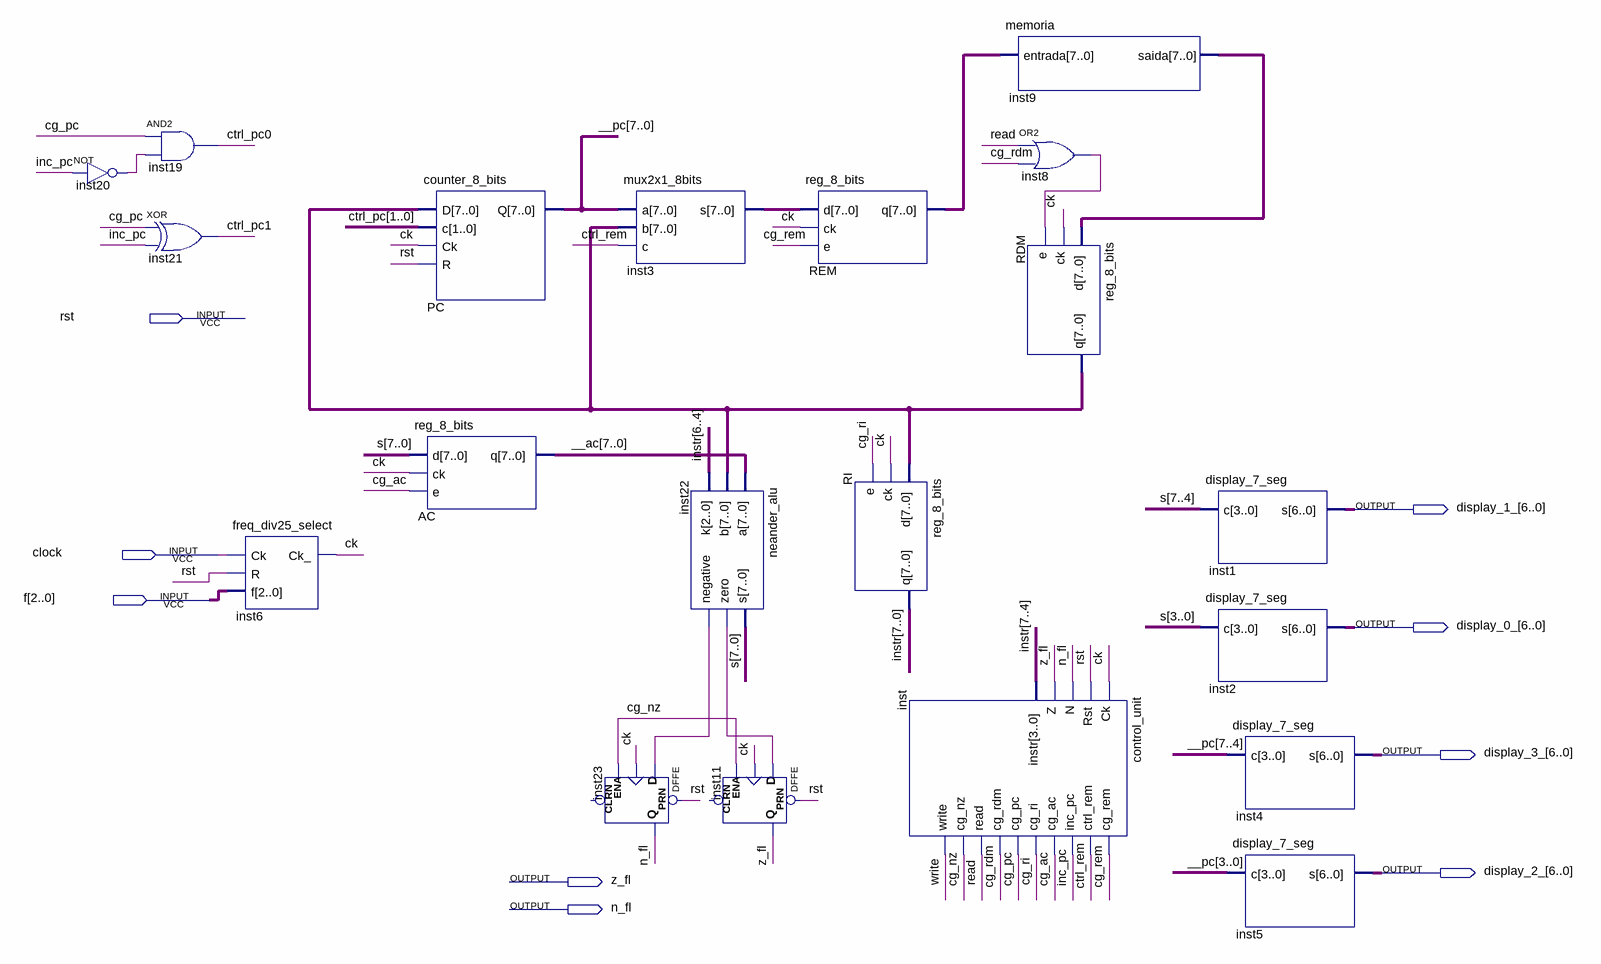
[diagram p0: schematic sheet]
// Quartus schematic Neander.bdf as structural Verilog: 20 symbols, 9 pins
module Neander (
  input  rst,
  input  clock,
  input  [2:0] f,
  output [6:0] display_1_,
  output [6:0] display_0_,
  output [6:0] display_3_,
  output [6:0] display_2_,
  output z_fl,
  output n_fl
);

  wire cg_ac, cg_nz, cg_pc, cg_rdm, cg_rem, cg_ri, ck, ctrl_rem, inc_pc, inst8_out, inst20_out,
       inst22_negative, inst22_zero, read, write;
  wire [1:0] ctrl_pc;
  wire [7:0] __ac, __pc, inst3_s, inst9_saida, instr, RDM_q, REM_q, s;

  not inst20 (inst20_out, inc_pc);
  and inst19 (ctrl_pc[0], cg_pc, inst20_out);
  xor inst21 (ctrl_pc[1], cg_pc, inc_pc);
  freq_div25_select inst6 (.Ck(clock), .R(rst), .f(f), .Ck_(ck));
  counter_8_bits PC (.D(RDM_q), .c(ctrl_pc), .Ck(ck), .R(rst), .Q(__pc));
  reg_8_bits AC (.d(s), .ck(ck), .e(cg_ac), .q(__ac));
  DFFE inst23 (.PRN(rst), .D(inst22_negative), .CLK(ck), .ENA(cg_nz), .Q(n_fl));  // open: CLRN
  mux2x1_8bits inst3 (.a(__pc), .b(RDM_q), .c(ctrl_rem), .s(inst3_s));
  neander_alu inst22 (.a(__ac), .b(RDM_q), .k(instr[6:4]), .s(s), .zero(inst22_zero), .negative(inst22_negative));
  DFFE inst11 (.PRN(rst), .D(inst22_zero), .CLK(ck), .ENA(cg_nz), .Q(z_fl));  // open: CLRN
  reg_8_bits REM (.d(inst3_s), .ck(ck), .e(cg_rem), .q(REM_q));
  reg_8_bits RI (.d(RDM_q), .ck(ck), .e(cg_ri), .q(instr));
  control_unit inst (
    .Ck(ck), .Rst(rst), .N(n_fl), .Z(z_fl), .instr(instr[7:4]), .cg_rem(cg_rem), .ctrl_rem(ctrl_rem),
    .inc_pc(inc_pc), .cg_ac(cg_ac), .cg_ri(cg_ri), .cg_pc(cg_pc), .cg_rdm(cg_rdm), .read(read),
    .cg_nz(cg_nz), .write(write));
  memoria inst9 (.entrada(REM_q), .saida(inst9_saida));
  or inst8 (inst8_out, read, cg_rdm);
  reg_8_bits RDM (.d(inst9_saida), .ck(ck), .e(inst8_out), .q(RDM_q));
  display_7_seg inst1 (.c(s[7:4]), .s(display_1_));
  display_7_seg inst2 (.c(s[3:0]), .s(display_0_));
  display_7_seg inst4 (.c(__pc[7:4]), .s(display_3_));
  display_7_seg inst5 (.c(__pc[3:0]), .s(display_2_));
endmodule
